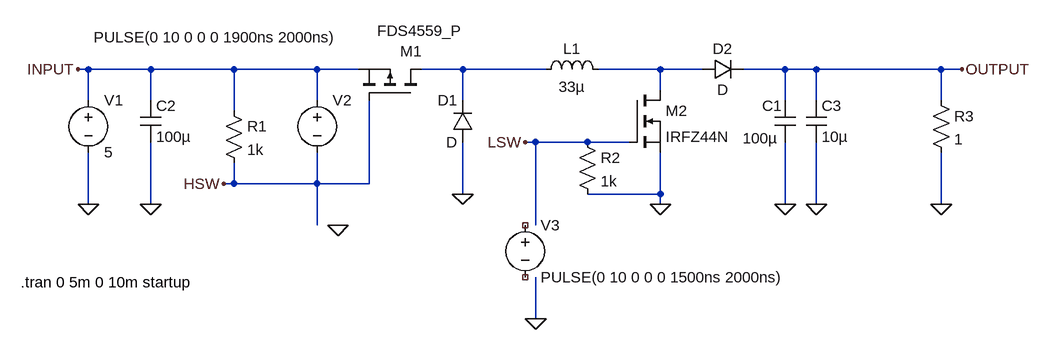
[diagram p0: schematic StepUpDown.asc]
StepUpDown.asc, the LTspice schematic file:
Version 4
SHEET 1 1232 680
WIRE -224 0 -240 0
WIRE -128 0 -224 0
WIRE 0 0 -128 0
WIRE 128 0 0 0
WIRE 192 0 128 0
WIRE 352 0 288 0
WIRE 480 0 352 0
WIRE 656 0 560 0
WIRE 720 0 656 0
WIRE 848 0 784 0
WIRE 896 0 848 0
WIRE 1088 0 896 0
WIRE 1120 0 1088 0
WIRE 656 32 656 0
WIRE -224 48 -224 0
WIRE -128 48 -128 0
WIRE 128 48 128 0
WIRE 352 48 352 0
WIRE 848 48 848 0
WIRE 896 48 896 0
WIRE 1088 48 1088 0
WIRE 0 64 0 0
WIRE 464 112 448 112
WIRE 544 112 464 112
WIRE 608 112 544 112
WIRE 0 176 0 144
WIRE 0 176 -16 176
WIRE 128 176 128 128
WIRE 128 176 0 176
WIRE 208 176 208 48
WIRE 208 176 128 176
WIRE 352 192 352 112
WIRE 656 192 656 128
WIRE 656 192 544 192
WIRE -224 208 -224 128
WIRE -128 208 -128 112
WIRE 656 208 656 192
WIRE 848 208 848 112
WIRE 896 208 896 112
WIRE 1088 208 1088 128
WIRE 128 240 128 176
WIRE 464 240 464 112
WIRE 464 384 464 320
FLAG -240 0 INPUT
FLAG -16 176 HSW
FLAG 352 192 0
FLAG 656 208 0
FLAG 848 208 0
FLAG 448 112 LSW
FLAG -128 208 0
FLAG 1120 0 OUTPUT
FLAG -224 208 0
FLAG 1088 208 0
FLAG 464 384 0
FLAG 160 240 0
FLAG 896 208 0
SYMBOL pmos 288 48 M270
WINDOW 0 76 32 VLeft 2
WINDOW 3 107 68 VLeft 2
SYMATTR InstName M1
SYMATTR Value FDS4559_P
SYMBOL res -16 48 R0
SYMATTR InstName R1
SYMATTR Value 1k
SYMBOL diode 368 112 R180
WINDOW 0 24 64 Left 2
WINDOW 3 24 0 Left 2
SYMATTR InstName D1
SYMBOL ind 464 16 R270
WINDOW 0 32 56 VTop 2
WINDOW 3 5 56 VBottom 2
SYMATTR InstName L1
SYMATTR Value 33µ
SYMATTR SpiceLine Rser=36m
SYMBOL nmos 608 32 R0
SYMATTR InstName M2
SYMATTR Value IRFZ44N
SYMBOL diode 720 16 R270
WINDOW 0 32 32 VTop 2
WINDOW 3 0 32 VBottom 2
SYMATTR InstName D2
SYMBOL cap 832 48 R0
WINDOW 0 -19 8 Left 2
WINDOW 3 -49 58 Left 2
SYMATTR InstName C1
SYMATTR Value 100µ
SYMATTR SpiceLine Rser=10m
SYMBOL res 528 96 R0
SYMATTR InstName R2
SYMATTR Value 1k
SYMBOL cap -144 48 R0
SYMATTR InstName C2
SYMATTR Value 100µ
SYMATTR SpiceLine Rser=100m
SYMBOL voltage -224 32 R0
WINDOW 123 0 0 Left 0
WINDOW 39 0 0 Left 0
SYMATTR InstName V1
SYMATTR Value 5
SYMBOL voltage 128 32 R0
WINDOW 3 -344 -81 Left 2
WINDOW 123 0 0 Left 0
WINDOW 39 0 0 Left 0
SYMATTR Value PULSE(0 10 0 0 0 1900ns 2000ns)
SYMATTR InstName V2
SYMBOL res 1072 32 R0
SYMATTR InstName R3
SYMATTR Value 1
SYMBOL voltage 448 224 R0
WINDOW 123 0 0 Left 0
WINDOW 39 0 0 Left 0
SYMATTR InstName V3
SYMATTR Value PULSE(0 10 0 0 0 1500ns 2000ns)
SYMBOL cap 880 48 R0
SYMATTR InstName C3
SYMATTR Value 10µ
SYMATTR SpiceLine Rser=10m
TEXT -328 328 Left 2 !.tran 0 5m 0 10m startup

The netlist it stands for:
* StepUpDown.asc
M1 N001 HSW INPUT INPUT FDS4559_P
R1 INPUT HSW 1k
D1 0 N001 D
L1 N001 N002 33µ Rser=36m
M2 N002 LSW 0 0 IRFZ44N
D2 N002 OUTPUT D
C1 OUTPUT 0 100µ Rser=10m
R2 LSW 0 1k
C2 INPUT 0 100µ Rser=100m
V1 INPUT 0 5
V2 INPUT HSW PULSE(0 10 0 0 0 1900ns 2000ns)
R3 OUTPUT 0 1
V3 NC_01 NC_02 PULSE(0 10 0 0 0 1500ns 2000ns)
C3 OUTPUT 0 10µ Rser=10m
.model D D
.lib standard.dio
.model NMOS NMOS
.model PMOS PMOS
.lib standard.mos
.tran 0 5m 0 10m startup
.backanno
.end